# Altium project CO2_Metar_PCB_Project.PrjPcb
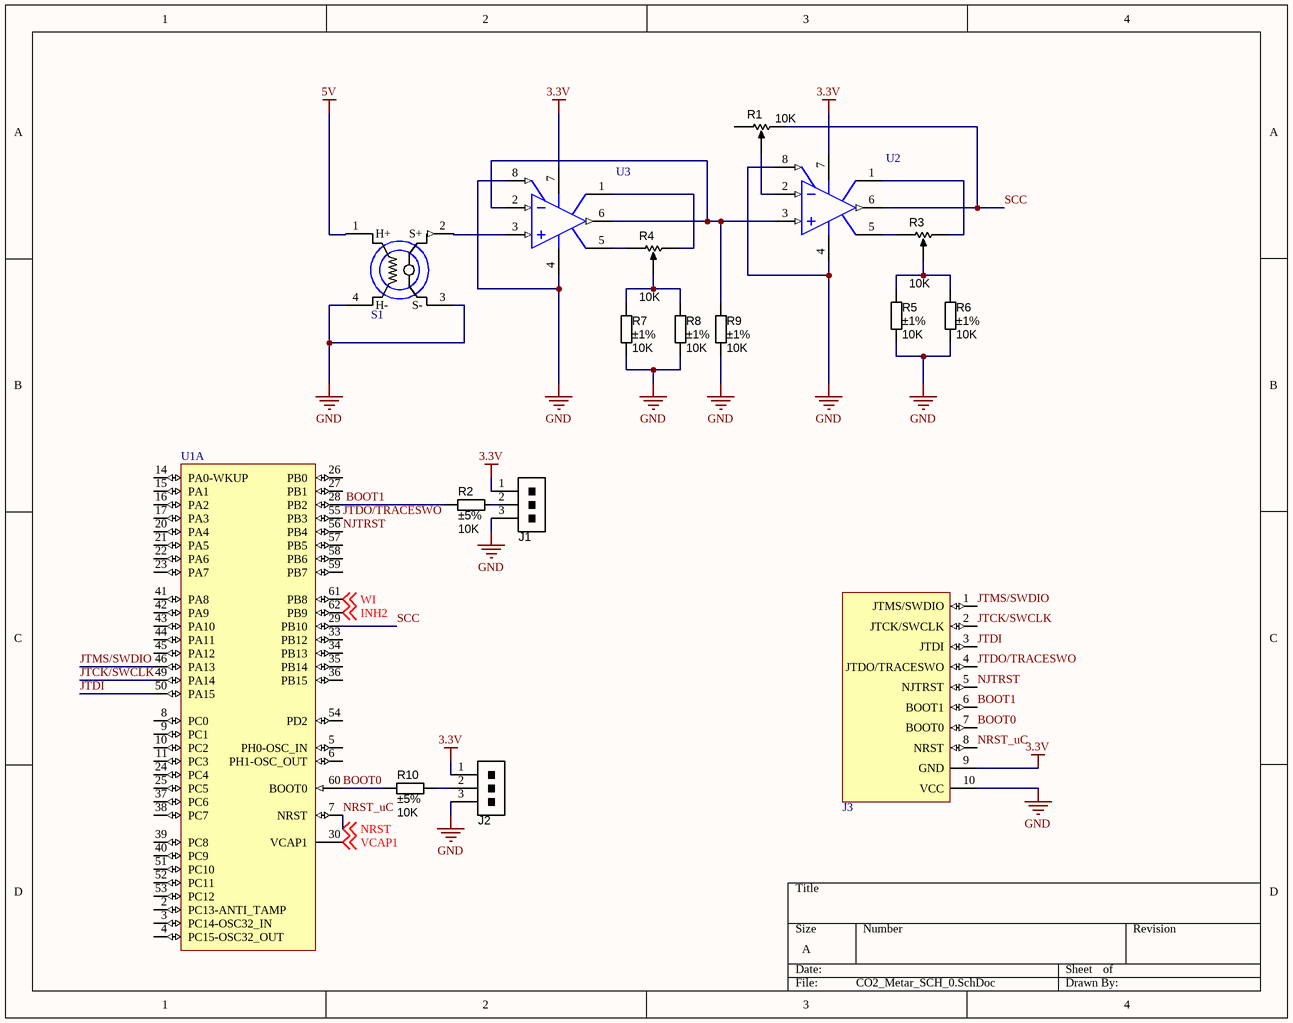
[diagram p0: CO2_Metar_SCH_0.SchDoc]
2 sheets, 40 parts. Net scope: global (net labels, ports and power ports of the same name join across sheets).
Board file: CO2_Metar_PCB.PcbDoc
Sheets:
  CO2_Metar_SCH_0.SchDoc
  CO2_Metar_SCH_1.SchDoc

## Sheet CO2_Metar_SCH_0.SchDoc
size A; DocumentNumber: 1; SheetNumber: 1; SheetTotal: 2

### Parts
J1  *  [1x3POS_HEADER]  (value not drawn)
J2  *  [1x3POS_HEADER]  (value not drawn)
J3  *  [SWJ-DP connector]  (value not drawn)
R1  value 10K  [TrimPot_SMD_Bourns_3214G]  (hidden comment: 5 Turn)
R2  value 10K  Tolerance: ±5%  [RESC1608X55N]  (hidden comment: Thick Film)
R3  value 10K  [TrimPot_SMD_Bourns_3214G]  (hidden comment: 5 Turn)
R4  value 10K  [TrimPot_SMD_Bourns_3214G]  (hidden comment: 5 Turn)
R5  value 10K  Tolerance: ±1%  [RESC1608X55N]  (hidden comment: Thick Film)
R6  value 10K  Tolerance: ±1%  [RESC1608X55N]  (hidden comment: Thick Film)
R7  value 10K  Tolerance: ±1%  [RESC1608X55N]  (hidden comment: Thick Film)
R8  value 10K  Tolerance: ±1%  [RESC1608X55N]  (hidden comment: Thick Film)
R9  value 10K  Tolerance: ±1%  [RESC1608X55N]  (hidden comment: Thick Film)
R10  value 10K  Tolerance: ±5%  [RESC1608X55N]  (hidden comment: Thick Film)
S1  *  [CO2_SENSOR]  (value not drawn)
U1  (no value)  [STM-LQFP64_N]  (part A of 2)
U2  (no value)  [D008_L]
U3  (no value)  [D008_L]

### Nets
3.3V: J1.1 J2.1 J3.9(GND) U2.7(V+) U3.7(V+)
5V: S1.1(H+)
GND: J1.3 J2.3 J3.10(VCC) R5.2 R6.2 R7.2 R8.2 R9.2 S1.3(S-) S1.4(H-) U2.4(V-) U2.8(BSEL) U3.4(V-) U3.8(BSEL)
BOOT0: J3.7(BOOT0) R10.2 U1.60(BOOT0)
BOOT1: J3.6(BOOT1) R2.2 U1.28(PB2)
INH2: U1.62(PB9) ; off-sheet INH2
JTCK/SWCLK: J3.2(JTCK/SWCLK) U1.49(PA14)
JTDI: J3.3(JTDI) U1.50(PA15)
JTDO/TRACESWO: J3.4(JTDO/TRACESWO) U1.55(PB3)
JTMS/SWDIO: J3.1(JTMS/SWDIO) U1.46(PA13)
NJTRST: J3.5(NJTRST) U1.56(PB4)
NRST_uC: J3.8(NRST) U1.7(NRST) ; off-sheet NRST  [also labelled NRST]
SCC: R1.3(CW) U1.29(PB10) U2.6(OUT)
VCAP1: U1.30(VCAP1) ; off-sheet VCAP1
WI: U1.61(PB8) ; off-sheet WI
NetJ1_2: J1.2 R2.1
NetJ2_2: J2.2 R10.1
NetR1_2: R1.2(WIPER) U2.2(IN-)
NetR3_1: R3.1(CCW) U2.5(OS_N2)
NetR3_2: R3.2(WIPER) R5.1 R6.1
NetR3_3: R3.3(CW) U2.1(OS_N1)
NetR4_1: R4.1(CCW) U3.5(OS_N2)
NetR4_2: R4.2(WIPER) R7.1 R8.1
NetR4_3: R4.3(CW) U3.1(OS_N1)
NetR9_1: R9.1 U2.3(IN+) U3.2(IN-) U3.6(OUT)
NetS1_2: S1.2(S+) U3.3(IN+)

Not connected (* = marked no-connect by the designer): R1 1(CCW); U1 2(PC13-ANTI_TAMP) 3(PC14-OSC32_IN) 4(PC15-OSC32_OUT) 5(PH0-OSC_IN) 6(PH1-OSC_OUT) 8(PC0) 9(PC1) 10(PC2) 11(PC3) 14(PA0-WKUP) 15(PA1) 16(PA2) 17(PA3) 20(PA4) 21(PA5) 22(PA6) 23(PA7) 24(PC4) 25(PC5) 26(PB0) 27(PB1) 33(PB12) 34(PB13) 35(PB14) 36(PB15) 37(PC6) 38(PC7) 39(PC8) 40(PC9) 41(PA8) 42(PA9) 43(PA10) 44(PA11) 45(PA12) 51(PC10) 52(PC11) 53(PC12) 54(PD2) 57(PB5) 58(PB6) 59(PB7)

### Library data of the parts
J1 J2 = CONN_HEADER_1x3P_0.100in: Pin Header, THT, Single-row, 2.54mm pitch; Manufacturer 1: 3M; Manufacturer Part Number 1: 929647-09-36-I; Pitch: 0.100" (2.54mm); Value: Single-row, 3 positions; QtyOverride: 0.1; SCDType: undef; Category: Connectors; Mounting Type: Through Hole; Terminal Block Type: Header, Male Pins, Single; Package / Case: Pin header; 2.54mm pitch; Supplier 1: Digi-Key; Supplier Part Number 1: 929647-09-36-ND
J3 = SWJ-Debug Port: 10 pin Serial Wire JTAG Debug Port
R1 R3 R4 = RES_TRIMMER_10K_5T_SMD: Trimmer SMD 10K 250mW 5-turn Side-adjust; Manufacturer 1: Bourns Inc.; Manufacturer Part Number 1: 3214G-1-103E; Tolerance: 10%; Ratings: 5 turn variable cermet; Number of Turns: 5; SCDType: spec; Supplier 1: Digi-Key; Supplier Part Number 1: 3214G-1-103ECT-ND
R2 R10 = RES_10K_0603_5%: Resistor SMD chip 10k Ohm 0.1W 5% 0603; Manufacturer 1: Yageo; Manufacturer Part Number 1: RC0603JR-0710KL; Ratings: 1/10 W; SCDType: spec; Package / Case: 0603 (1608 metric); Material: Thick Film; Supplier 1: Digi-Key; Supplier Part Number 1: 311-10KGRCT-ND; Supplier 2: Digi-Key; Supplier Part Number 2: 541-10KGCT-ND; Manufacturer 2: Vishay Dale; Manufacturer Part Number 2: CRCW060310K0JNEA; ComponentLink2URL: http://www.vishay.com/doc?20035; ComponentLink2Description: http://www.vishay.com/doc?20035; ComponentLink1URL: http://www.yageo.com/documents/recent/PYu-RC0603_51_RoHS_L_4.pdf; ComponentLink1Description: http://www.yageo.com/documents/recent/PYu-RC0603_51_RoHS_L_4.pdf
R5-R9 = RES_10K_0603_1%: Resistor SMD chip 10k Ohm 0.1W 1% 0603; Manufacturer 1: Yageo; Manufacturer Part Number 1: RC0603FR-0710KL; Ratings: 1/10W; SCDType: spec; Package / Case: 0603 (1608 Metric); Supplier 1: Digi-Key; Supplier Part Number 1: 311-10.0KHRCT-ND
S1 = TGS4161: Solid electrolyte type Carbon Dioxide sensor
U1 = STM32F401RBT6: ARM Cortex-M4 32-bit MCU+FPU, 105 DMIPS, 128 kB Flash, 64 kB Internal RAM, 48 I/Os, 64-pin LQFP, -40 to 85 degC, Tray; Manufacturer: STMicroelectronics; FLASH Size (Prog) (kB): 128; I/Os (High Current): 48; Internal RAM Size (kB): 64; Operating Frequency(F) (Processor speed) (MHz): 84; Supply Voltage(Vcc) max (V): 3.6; Supply Voltage(Vcc) min (V): 1.8; DatasheetVersion: Rev. 1; PackageVersion: Rev. 4, 06/2013; PackageReference: LQFP64; PackageDescription: 64-Pin Low Profile Quad Flat Package, 10 x 10 mm Body, 0.5 mm Pitch; Supplier 1: Newark; Supplier Part Number 1: 19X6220; Supplier 2: Mouser; Supplier Part Number 2: 511-STM32F401RBT6; Core: ARM Cortex-M4; Packing: Tray; Mounting Technology: Surface Mount; PartNumber: STM32F401RBT6; ComponentLink1Description: Manufacturer URL; ComponentLink1URL: http://www.st.com/web/en/home.html; ComponentLink2Description: Datasheet; ComponentLink2URL: http://www.st.com/st-web-ui/static/active/en/resource/technical/document/data_brief/DM00071938.pdf; ComponentLink3Description: Package Specification; ComponentLink3URL: http://www.st.com/st-web-ui/static/active/en/resource/technical/document/datasheet/DM00037051.pdf
U2 U3 = TLC271AID: LinCMOS Programmable Low-Power Operational Amplifier; Published: 15-Apr-2002; LatestRevisionDate: 13-Apr-2006; LatestRevisionNote: IPC-7351 Footprint Added.; DatasheetVersion: Mar-1989; PackageVersion: Jan-1998; PackageReference: D008; Publisher: Altium Limited; PackageDescription: 8-Pin Small Outline Integrated Circuit 1.27 mm Pitch; Code_IPC: SOIC127P600-8; ComponentLink1Description: Manufacturer Link; ComponentLink1URL: http://www.ti.com/; ComponentLink2Description: Datasheet; ComponentLink2URL: http://www-s.ti.com/sc/ds/tlc271.pdf

## Sheet CO2_Metar_SCH_1.SchDoc
size A; DocumentNumber: 2; SheetNumber: 2; SheetTotal: 2
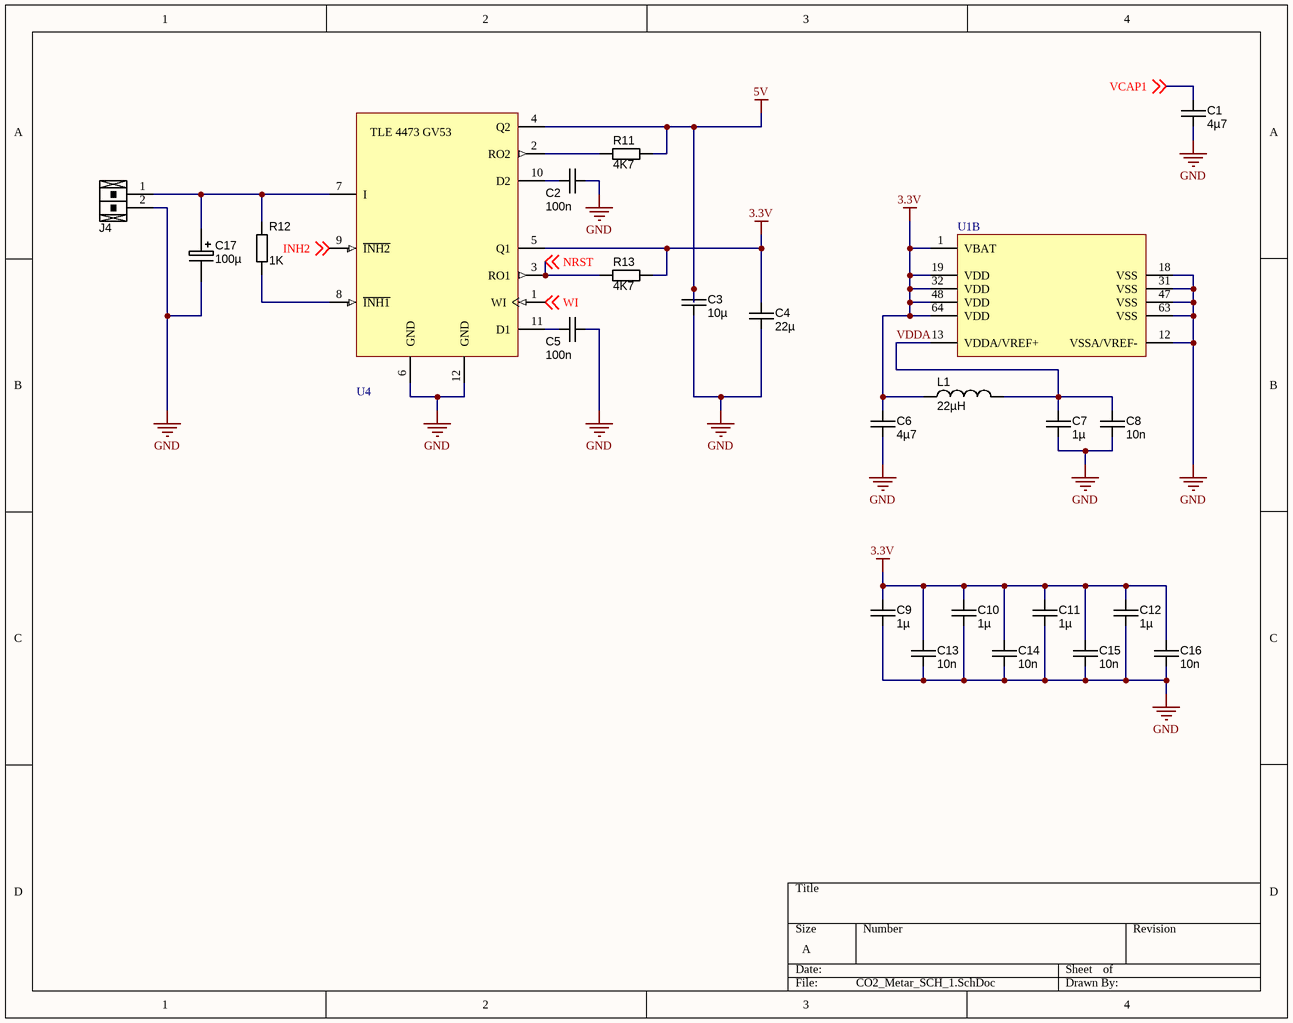
[diagram p1: CO2_Metar_SCH_1.SchDoc]

### Parts
C1  value 4µ7  [CAPC2012X135N]  (hidden comment: approved sub OK)
C2  value 100n  [CAPC1608X90N]  (hidden comment: approved sub OK)
C3  10µ  [CAPC3225X220N]
C4  value 22µ  [CAPC4532X280N]  (hidden comment: approved sub OK)
C5  value 100n  [CAPC1608X90N]  (hidden comment: approved sub OK)
C6  value 4µ7  [CAPC2012X135N]  (hidden comment: approved sub OK)
C7  value 1µ  [CAPC2012X135N]  (hidden comment: approved sub OK)
C8  value 10n  [CAPC1608X90N]  (hidden comment: approved sub OK)
C9  value 1µ  [CAPC2012X135N]  (hidden comment: approved sub OK)
C10  value 1µ  [CAPC2012X135N]  (hidden comment: approved sub OK)
C11  value 1µ  [CAPC2012X135N]  (hidden comment: approved sub OK)
C12  value 1µ  [CAPC2012X135N]  (hidden comment: approved sub OK)
C13  value 10n  [CAPC1608X90N]  (hidden comment: approved sub OK)
C14  value 10n  [CAPC1608X90N]  (hidden comment: approved sub OK)
C15  value 10n  [CAPC1608X90N]  (hidden comment: approved sub OK)
C16  value 10n  [CAPC1608X90N]  (hidden comment: approved sub OK)
C17  100µ  [CAPAE200P550X1200_FLAT2]
J4  *  [2P_PCB_TERM_BLOCK_HDR]  (value not drawn)
L1  22µH  [IND_Coilcraft_DO3316P_SM]
R11  value 4K7  [RESC1608X55N]  (hidden comment: Thick Film)
R12  value 1K  [RESC1608X55N]  (hidden comment: Thick Film)
R13  value 4K7  [RESC1608X55N]  (hidden comment: Thick Film)
U1  (no value)  [STM-LQFP64_N]  (part B of 2)
U4  *  [PG-DSO-12NTS]  (value not drawn)

### Nets
3.3V: C4.1 C6.1 C9.1 C10.1 C11.1 C12.1 C13.1 C14.1 C15.1 C16.1 L1.1 R13.2 U1.1(VBAT) U1.19(VDD) U1.32(VDD) U1.48(VDD) U1.64(VDD) U4.5(Q1)
5V: C3.1 R11.2 U4.4(Q2)
GND: C1.2 C2.2 C3.2 C4.2 C5.2 C6.2 C7.2 C8.2 C9.2 C10.2 C11.2 C12.2 C13.2 C14.2 C15.2 C16.2 C17.2 J4.2 U1.12(VSSA/VREF-) U1.18(VSS) U1.31(VSS) U1.47(VSS) U1.63(VSS) U4.6(GND) U4.12(GND)
INH2: U4.9(~{INH2}) ; off-sheet INH2
NRST: R13.1 U4.3(RO1) ; off-sheet NRST  [project net NRST_uC]
VCAP1: C1.1 ; off-sheet VCAP1
VDDA: C7.1 C8.1 L1.2 U1.13(VDDA/VREF+)
WI: U4.1(WI) ; off-sheet WI
NetC2_1: C2.1 U4.10(D2)
NetC5_1: C5.1 U4.11(D1)
NetC17_1: C17.1 J4.1 R12.1 U4.7(I)
NetR11_1: R11.1 U4.2(RO2)
NetR12_2: R12.2 U4.8(~{INH1})

### Notes on the sheet
- (in symbol TLE4473-GV53) TLE 4473 GV53

### Library data of the parts
C1 C6 = CAPC_4u7_0805: Capacitor SMD Cer 4.7uF 10% 16V X5R 0805; Manufacturer 1: Taiyo Yuden; Manufacturer Part Number 1: EMK212BJ475KG-T; Ratings: 16V; X5R; Material: ceramic; SCDType: spec; Package / Case: 0805 (2012 Metric); Tolerance: ±10%; Supplier 1: Digi-Key; Supplier Part Number 1: 587-1294-1-ND; Operating Temperature: -55°C ~ 85°C; Size / Dimension: 0.079" L x 0.049" W (2.00mm x 1.25mm); Thickness (Max): 0.053" (1.35mm); ComponentLink1URL: http://www.yuden.co.jp/productdata/catalog/en/mlcc01_e.pdf; ComponentLink1Description: http://www.yuden.co.jp/productdata/catalog/en/mlcc01_e.pdf; Supplier 2: Digi-Key; Supplier Part Number 2: 1276-1065-1-ND; Manufacturer 2: Samsung Electro-Mechanics America, Inc; Manufacturer Part Number 2: CL21A475KOFNNNE; RoHS 2: RoHS Compliant; ComponentLink2URL: http://www.samsungsem.com/servlet/FileDownload?type=spec&file=CL21A475KOFNNNE.pdf; ComponentLink2Description: http://www.samsungsem.com/servlet/FileDownload?type=spec&file=CL21A475KOFNNNE.pdf; Supplier 3: Digi-Key; Supplier Part Number 3: 399-8101-1-ND; Manufacturer 3: Kemet; Manufacturer Part Number 3: C0805C475K4PACTU; RoHS 3: RoHS Compliant; ComponentLink3URL: http://capacitoredge.kemet.com/capedge2/DataSheet?pn=C0805C475K4PACTU; ComponentLink3Description: http://capacitoredge.kemet.com/capedge2/DataSheet?pn=C0805C475K4PACTU; Supplier 4: Digi-Key; Supplier Part Number 4: 490-7215-1-ND; Manufacturer 4: Murata Electronics North America; Manufacturer Part Number 4: GRM21BR61C475MA88L; RoHS 4: RoHS Compliant; ComponentLink4URL: http://psearch.murata.com/capacitor/product/GRM21BR61C475MA88#.pdf; ComponentLink4Description: http://psearch.murata.com/capacitor/product/GRM21BR61C475MA88#.pdf; Supplier 5: Digi-Key; Supplier Part Number 5: 445-7640-1-ND; Manufacturer 5: TDK Corporation; Manufacturer Part Number 5: C2012X5R1C475K125AC; RoHS 5: RoHS Compliant; ComponentLink5URL: http://product.tdk.com/capacitor/mlcc/en/documents/mlcc_commercial_general_en.pdf; ComponentLink5Description: http://product.tdk.com/capacitor/mlcc/en/documents/mlcc_commercial_general_en.pdf; RoHS 1: RoHS Compliant
C2 C5 = CAPC_100n_0603_X7R_50V_10%: Capacitor SMD Cer 100nF 10% 50V X7R 0603; Manufacturer 1: AVX Corporation; Manufacturer Part Number 1: 06035C104KAT2A; Ratings: 50V; X7R; Material: ceramic; SCDType: spec; Manufacturer 2: TDK Corporation; Manufacturer Part Number 2: C1608X7R1H104K; Package / Case: 0603 (1608 Metric); Tolerance: ±10%; Supplier 1: Digi-Key; Supplier Part Number 1: 478-5052-1-ND; ComponentLink1URL: http://www.avx.com/docs/Catalogs/cx7r.pdf; ComponentLink1Description: http://www.avx.com/docs/Catalogs/cx7r.pdf; Supplier 2: Digi-Key; Supplier Part Number 2: 445-1314-1-ND; ComponentLink2URL: http://product.tdk.com/capacitor/mlcc/en/documents/mlcc_commercial_general_en.pdf; ComponentLink2Description: http://product.tdk.com/capacitor/mlcc/en/documents/mlcc_commercial_general_en.pdf
C3 = CAPC_10u_1210_50V: Capacitor SMD Cer 10uF 20% 16V X5R 1210; Manufacturer 1: Taiyo Yuden; Manufacturer Part Number 1: UMK325BJ106MM-T; Ratings: 50V; X5R; Material: ceramic; SCDType: spec; Package / Case: 1210 (3225 Metric); Tolerance: ±20%; Size / Dimension: 0.126" L x 0.098" W (3.20mm x 2.50mm); Supplier 1: Digi-Key; Supplier Part Number 1: 587-2225-1-ND; Value: 10µ
C4 = CAPC_22u_1812_25V: Capacitor SMD Cer 22uF 20% 25V X5R 1812; Manufacturer 1: TDK Corporation; Manufacturer Part Number 1: C4532X5R1E226M; Ratings: 25V; X5R; Material: ceramic; SCDType: undef; Package / Case: 1812 (4532 metric); Tolerance: ±20%; Supplier 1: Digi-Key; Supplier Part Number 1: 445-1444-1-ND
C7 C9-C12 = CAPC_1u_0805_X7R_16V_10%: Capacitor SMD Cer 1uF 10% 16V X7R 0805; Manufacturer 1: Yageo; Manufacturer Part Number 1: CC0805KKX7R7BB105; Ratings: 16V; X7R; Material: ceramic; SCDType: spec; Package / Case: 0805 (2012 metric); Tolerance: ±10%; Supplier 1: Digi-Key; Supplier Part Number 1: 311-1365-6-ND; RoHS 1: RoHS Compliant; Temperature Coefficient: X7R; ComponentLink1URL: http://www.yageo.com/documents/recent/UPY-GPHC_X7R_6.3V-to-50V_8.pdf; ComponentLink1Description: http://www.yageo.com/documents/recent/UPY-GPHC_X7R_6.3V-to-50V_8.pdf; Supplier 2: Digi-Key; Supplier Part Number 2: 399-1284-6-ND; Manufacturer 2: Kemet; Manufacturer Part Number 2: C0805C105K4RACTU; RoHS 2: RoHS Compliant; ComponentLink2URL: http://www.kemet.com/datasheets&C0805C105K4RACTU; ComponentLink2Description: http://www.kemet.com/datasheets&C0805C105K4RACTU; Supplier 3: Digi-Key; Supplier Part Number 3: 1276-1026-6-ND; Manufacturer 3: Samsung Electro-Mechanics America, Inc; Manufacturer Part Number 3: CL21B105KOFNNNE; RoHS 3: RoHS Compliant; ComponentLink3URL: http://www.samsungsem.com/servlet/FileDownload?type=spec&file=CL21B105KOFNNNE.pdf; ComponentLink3Description: http://www.samsungsem.com/servlet/FileDownload?type=spec&file=CL21B105KOFNNNE.pdf; Supplier 4: Digi-Key; Supplier Part Number 4: 445-1358-6-ND; Manufacturer 4: TDK Corporation; Manufacturer Part Number 4: C2012X7R1C105K125AA; RoHS 4: RoHS Compliant; ComponentLink4URL: http://product.tdk.com/capacitor/mlcc/en/documents/mlcc_commercial_general_en.pdf; ComponentLink4Description: http://product.tdk.com/capacitor/mlcc/en/documents/mlcc_commercial_general_en.pdf
C8 = CAPC_10n_0603_X7R_50V_10%: Capacitor SMD Cer 10nF 10% 50V X7R 0603; Manufacturer 1: TDK Corporation; Manufacturer Part Number 1: C1608X7R1H103K; Ratings: 50V; X7R; Material: ceramic; SCDType: spec; Package / Case: 0603 (1608 metric); Tolerance: ±10%; Supplier 1: Digi-Key; Supplier Part Number 1: 445-1311-1-ND; ComponentLink1URL: http://product.tdk.com/capacitor/mlcc/en/documents/mlcc_commercial_general_en.pdf; ComponentLink1Description: http://product.tdk.com/capacitor/mlcc/en/documents/mlcc_commercial_general_en.pdf; Supplier 2: Digi-Key; Supplier Part Number 2: 478-1227-1-ND; Manufacturer 2: AVX Corporation; Manufacturer Part Number 2: 06035C103KAT2A; ComponentLink2URL: http://www.avx.com/docs/Catalogs/cx7r.pdf; ComponentLink2Description: http://www.avx.com/docs/Catalogs/cx7r.pdf
C13-C16 = CAPC_10n_0603_X7R_50V_10%: Capacitor SMD Cer 10nF 10% 50V X7R 0603; Manufacturer 1: TDK Corporation; Manufacturer Part Number 1: C1608X7R1H103K; Ratings: 50V; X7R; SCDType: spec; Material: ceramic; Tolerance: ±10%; Package / Case: 0603 (1608 metric); Supplier 1: Digi-Key; Supplier Part Number 1: 445-1311-1-ND; ComponentLink1URL: http://product.tdk.com/capacitor/mlcc/en/documents/mlcc_commercial_general_en.pdf; ComponentLink1Description: http://product.tdk.com/capacitor/mlcc/en/documents/mlcc_commercial_general_en.pdf; Supplier 2: Digi-Key; Supplier Part Number 2: 478-1227-1-ND; Manufacturer 2: AVX Corporation; Manufacturer Part Number 2: 06035C103KAT2A; ComponentLink2URL: http://www.avx.com/docs/Catalogs/cx7r.pdf; ComponentLink2Description: http://www.avx.com/docs/Catalogs/cx7r.pdf
C17 = CAPE_100u_16V_THD: Capacitor THD Electrolytic 100uF 20% 16V Radial; Manufacturer: Panasonic - ECG; Manufacturer Part Number: ECA-1CM101; Material: Aluminum Electrolytic; SCDType: spec; Package / Case: Radial - Through hole; Ratings: 16V; Tolerance: ±20%; Supplier 1: Digi-Key; Supplier Part Number 1: P5138-ND; Value: 100µ
J4 = 2P_TERM_BLOCK_HEADER: Terminal Block THT 2-position header 3.81mm pitch; Manufacturer 1: TE Connectivity; Manufacturer Part Number 1: 284517-2; Pitch: 0.150" (3.81mm); Voltage: 300V; Positions Per Level: 2; Mating Connector: 284507-2; SCDType: undef; Category: Connectors; Mounting Type: Through Hole; Terminal Block Type: Header, Male Pins, Right-angle, Shrouded (4 Side); Package / Case: Header; 3.81mm pitch; Supplier 1: Digi-Key; Supplier Part Number 1: A98410-ND
L1 = INDC_22u_DO3316P-223: Inductor Power SMD 22µH; Manufacturer 1: Coilcraft; Manufacturer Part Number 1: DO3316P-223KL; Ratings: 2.3 Adc; Tolerance: ±10%; Value: 22µ; SCDType: spec; Package / Case: 12.95x9.4mm
R11 R13 = RES_4K7_0603_5%: Resistor SMD chip 4.7k Ohm 0.1W 5% 0603; Manufacturer 1: Vishay/Dale; Manufacturer Part Number 1: CRCW06034K70JNEA; Ratings: 1/10 W; SCDType: spec; Package / Case: 0603 (1608 metric); Tolerance: ±5%; Material: Thick Film; Supplier 1: Digi-Key; Supplier Part Number 1: 541-4.7KGCT-ND
R12 = RES_1K_0603_5%: Resistor SMD chip 1k Ohm 0.1W 5% 0603; Manufacturer 1: Yageo; Manufacturer Part Number 1: RC0603JR-071KL; Ratings: 1/10 W; SCDType: spec; Package / Case: 0603 (1608 metric); Tolerance: ±5%; Material: Thick Film; Supplier 1: Digi-Key; Supplier Part Number 1: 311-1.0KGRCT-ND; Supplier 2: Digi-Key; Supplier Part Number 2: 541-1.0KGCT-ND; Manufacturer 2: Vishay Dale; Manufacturer Part Number 2: CRCW06031K00JNEA; ComponentLink2URL: http://www.vishay.com/doc?20008; ComponentLink2Description: http://www.vishay.com/doc?20008; ComponentLink1URL: http://www.yageo.com/documents/recent/PYu-RC0603_51_RoHS_L_4.pdf; ComponentLink1Description: http://www.yageo.com/documents/recent/PYu-RC0603_51_RoHS_L_4.pdf
U1 = STM32F401RBT6: as U1 on sheet CO2_Metar_SCH_0; DatasheetVersion: Rev. 1; PackageVersion: Rev. 4, 06/2013; PackageReference: LQFP64; PackageDescription: 64-Pin Low Profile Quad Flat Package, 10 x 10 mm Body, 0.5 mm Pitch; Supplier 1: Newark; Supplier Part Number 1: 19X6220; Supplier 2: Mouser; Supplier Part Number 2: 511-STM32F401RBT6; Core: ARM Cortex-M4; Packing: Tray; Mounting Technology: Surface Mount; PartNumber: STM32F401RBT6; ComponentLink1Description: Manufacturer URL; ComponentLink1URL: http://www.st.com/web/en/home.html; ComponentLink2Description: Datasheet; ComponentLink2URL: http://www.st.com/st-web-ui/static/active/en/resource/technical/document/data_brief/DM00071938.pdf; ComponentLink3Description: Package Specification; ComponentLink3URL: http://www.st.com/st-web-ui/static/active/en/resource/technical/document/datasheet/DM00037051.pdf
U4 = TLE4473-GV53: Dual Low Drop Voltage Regulator

## Nets that join several sheets
3.3V: CO2_Metar_SCH_0 (5 pins), CO2_Metar_SCH_1 (18 pins)
5V: CO2_Metar_SCH_0 (S1.1), CO2_Metar_SCH_1 (C3.1 R11.2 U4.4)
GND: CO2_Metar_SCH_0 (14 pins), CO2_Metar_SCH_1 (25 pins)
INH2: CO2_Metar_SCH_0 (U1.62), CO2_Metar_SCH_1 (U4.9)
NRST_uC: CO2_Metar_SCH_0 (J3.8 U1.7), CO2_Metar_SCH_1 (R13.1 U4.3)
VCAP1: CO2_Metar_SCH_0 (U1.30), CO2_Metar_SCH_1 (C1.1)
WI: CO2_Metar_SCH_0 (U1.61), CO2_Metar_SCH_1 (U4.1)